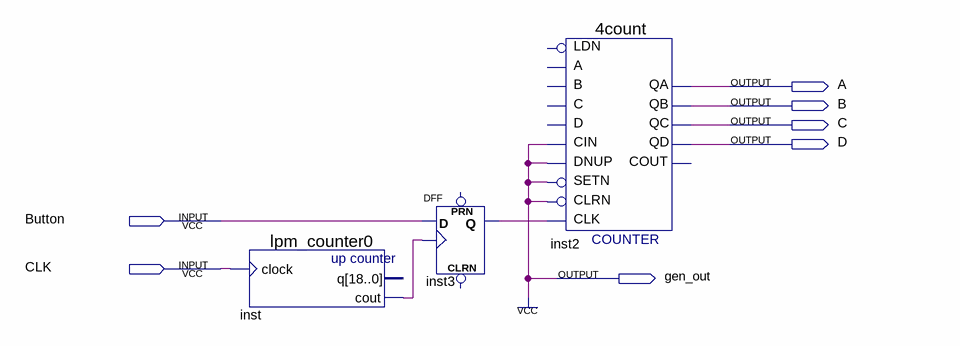
[diagram p0: schematic sheet]
// Quartus schematic scheme2.bdf as structural Verilog: 3 symbols, 7 pins
module scheme2 (
  input  Button,
  input  CLK,
  output A,
  output B,
  output C,
  output D,
  output gen_out
);

  wire inst3_q, inst_cout;

  lpm_counter0 inst (.clock(CLK), .cout(inst_cout));  // open: q
  DFF inst3 (.CLK(inst_cout), .D(Button), .Q(inst3_q));  // open: CLRN, PRN
  \4count  inst2 (
    .CIN(1'b1), .DNUP(1'b1), .CLK(inst3_q), .SETN(1'b1), .CLRN(1'b1), .QA(A), .QB(B), .QC(C), .QD(D));  // open: LDN, B, A, D, C, COUT

  assign gen_out = 1'b1;
endmodule
